# Altium schematic sheet Mbed.SchDoc: STM32
size A4; DrawnBy: Alex Dyer; Revision: A; SheetNumber: 2; SheetTotal: 5
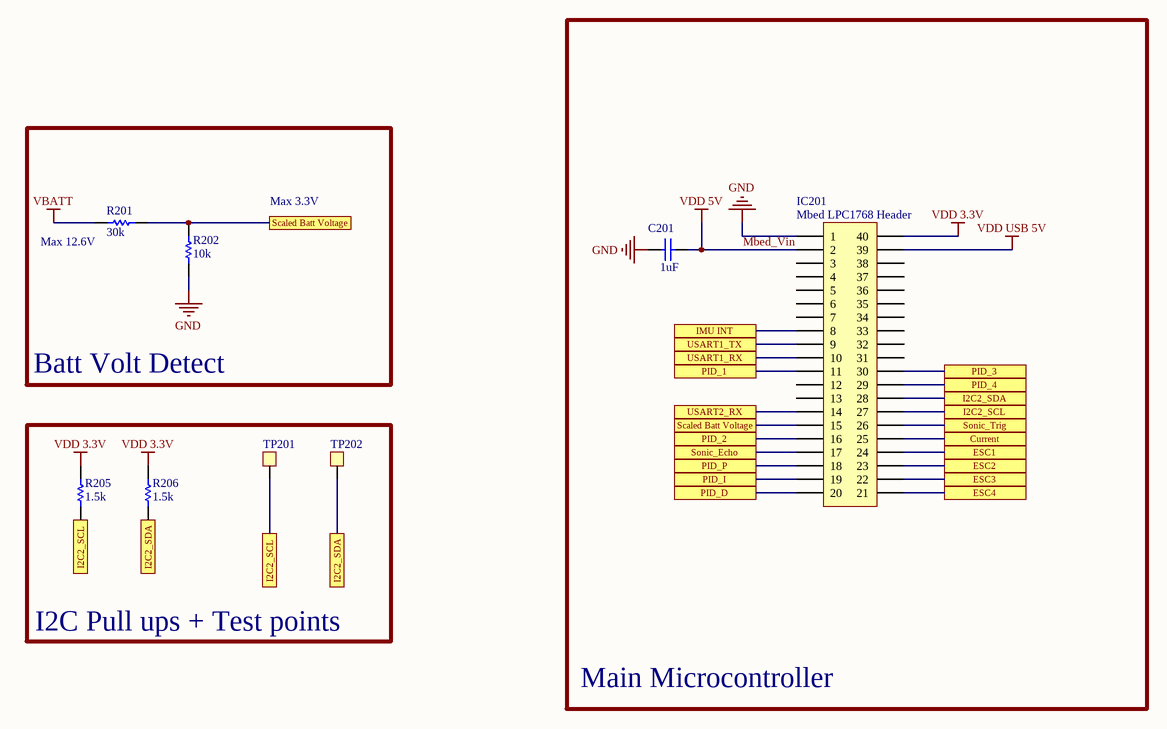
[diagram p0: Mbed.SchDoc]

## Parts
C201  value 1uF  [0805 Cap]  (hidden comment: 0805)
IC201  Mbed LPC1768 Header  [Mbed LPC1768]
R201  value 30k  [0603]  (hidden comment: 0603)
R202  value 10k  [0603]  (hidden comment: 0603)
R205  value 1.5k  [0603]  (hidden comment: 0603)
R206  value 1.5k  [0603]  (hidden comment: 0603)
TP201  Test Point  [Test Point THT 1mm]  (value not drawn)
TP202  Test Point  [Test Point THT 1mm]  (value not drawn)

## Blocks framed on the sheet
Main Microcontroller: C201 IC201
Batt Volt Detect: R201 R202
I2C Pull ups + Test points: R205 R206 TP201 TP202

## Ports
Current, ESC1, ESC2, ESC3, ESC4, I2C2_SCL, I2C2_SDA, IMU INT, PID_1, PID_2, PID_3, PID_4, PID_D, PID_I, PID_P, Scaled Batt Voltage, Sonic_Echo, Sonic_Trig, USART1_RX, USART1_TX, USART2_RX

## Nets
GND: C201.2 IC201.1 R202.2
Mbed_Vin: C201.1 IC201.2  [also labelled VDD 5V]
VBATT: R201.1
VDD 3.3V: IC201.40 R205.1 R206.1
VDD USB 5V: IC201.39
Current: IC201.25 ; port Current
ESC1: IC201.24 ; port ESC1
ESC2: IC201.23 ; port ESC2
ESC3: IC201.22 ; port ESC3
ESC4: IC201.21 ; port ESC4
I2C2_SCL: IC201.27 R205.2 TP201.1 ; port I2C2_SCL
I2C2_SDA: IC201.28 R206.2 TP202.1 ; port I2C2_SDA
IMU INT: IC201.8 ; port IMU INT
PID_1: IC201.11 ; port PID_1
PID_2: IC201.16 ; port PID_2
PID_3: IC201.30 ; port PID_3
PID_4: IC201.29 ; port PID_4
PID_D: IC201.20 ; port PID_D
PID_I: IC201.19 ; port PID_I
PID_P: IC201.18 ; port PID_P
Scaled Batt Voltage: IC201.15 R201.2 R202.1 ; port Scaled Batt Voltage
Sonic_Echo: IC201.17 ; port Sonic_Echo
Sonic_Trig: IC201.26 ; port Sonic_Trig
USART1_RX: IC201.10 ; port USART1_RX
USART1_TX: IC201.9 ; port USART1_TX
USART2_RX: IC201.14 ; port USART2_RX

Not connected (* = marked no-connect by the designer): IC201 3 4 5 6 7 12 13 31 32 33 34 35 36 37 38

## Notes on the sheet
- (near R201) Max 12.6V
- Max 3.3V
- Title:
- Size:
- Date:
- A4
- Drawn By:
- Time:
- Sheet
- Revision:
- of

## Library data of the parts
C201 = Cap: Capacitor Box; Published: 8-Jun-2000; LatestRevisionDate: 17-Jul-2002; LatestRevisionNote: Re-released for DXP Platform.; PackageReference: RAD-0.3; Publisher: Altium Limited; PackageDescription: Radial Cap, Thru-Hole; 2 Leads; 0.3 in Pin Spacing; Catalogue No.: Capacitor Box
IC201 = Header 20X2: https://www.mouser.co.uk/ProductDetail/3M-Electronic-Solutions-Division/929850-01-20-RB?qs=sGAEpiMZZMs%252BGHln7q6pmzzqnf3%2F1AeI8GQqYPHkSyE%3D; Catalogue No.: 517-929850-01-20-RB; LatestRevisionDate: 17-Jul-2002; LatestRevisionNote: Re-released for DXP Platform.; Publisher: Altium Limited; Headers: 929850-01-20-RB
R201 R202 R205 R206 = Res1: Resistor; Published: 8-Jun-2000; LatestRevisionDate: 17-Jul-2002; LatestRevisionNote: Re-released for DXP Platform.; PackageReference: AXIAL-0.3; Publisher: Altium Limited; PackageDescription: Axial Device, Thru-Hole; 2 Leads; 0.3 in Pin Spacing; ComponentLink1Description: Purcahse; ComponentLink1URL: https://uk.rs-online.com/web/p/mlccs-multilayer-ceramic-capacitors/2644236/; Purchase: https://uk.rs-online.com/web/p/mlccs-multilayer-ceramic-capacitors/2644236/
TP201 TP202 = Test Point: ComponentLink1Description: Purchase; ComponentLink1URL: https://uk.rs-online.com/web/p/terminal-posts/2622179/?relevancy-data=7365617263685F636173636164655F6F726465723D31267365617263685F696E746572666163655F6E616D653D4931384E525353746F636B4E756D626572267365617263685F6C616E67756167655F757365643D656E267365617263685F6D617463685F6D6F64653D6D61746368616C6C267365617263685F7061747465726E5F6D6174636865643D5E2828282872737C5253295B205D3F293F285C647B337D5B5C2D5C735D3F5C647B332C347D5B705061415D3F29297C283235285C647B387D7C5C647B317D5C2D5C647B377D29292924267365617263685F7061747465726E5F6F726465723D31267365617263685F73745F6E6F726D616C697365643D59267365617263685F726573706F6E73655F616374696F6E3D267365617263685F747970653D52535F53544F434B5F4E554D424552267365617263685F77696C645F63617264696E675F6D6F64653D4E4F4E45267365617263685F6B6579776F72643D3236322D32313739267365617263685F6B6579776F72645F6170703D32363232313739267365617263685F636F6E6669673D3026&searchHistory=%7B%22enabled%22%3Atrue%7D\; Purchase: https://uk.rs-online.com/web/p/terminal-posts/2622179/?relevancy-data=7365617263685F636173636164655F6F726465723D31267365617263685F696E746572666163655F6E616D653D4931384E525353746F636B4E756D626572267365617263685F6C616E67756167655F757365643D656E267365617263685F6D617463685F6D6F64653D6D61746368616C6C267365617263685F7061747465726E5F6D6174636865643D5E2828282872737C5253295B205D3F293F285C647B337D5B5C2D5C735D3F5C647B332C347D5B705061415D3F29297C283235285C647B387D7C5C647B317D5C2D5C647B377D29292924267365617263685F7061747465726E5F6F726465723D31267365617263685F73745F6E6F726D616C697365643D59267365617263685F726573706F6E73655F616374696F6E3D267365617263685F747970653D52535F53544F434B5F4E554D424552267365617263685F77696C645F63617264696E675F6D6F64653D4E4F4E45267365617263685F6B6579776F72643D3236322D32313739267365617263685F6B6579776F72645F6170703D32363232313739267365617263685F636F6E6669673D3026&searchHistory=%7B%22enabled%22%3Atrue%7D\